# Altium schematic sheet USB_Headers.SchDoc
size A
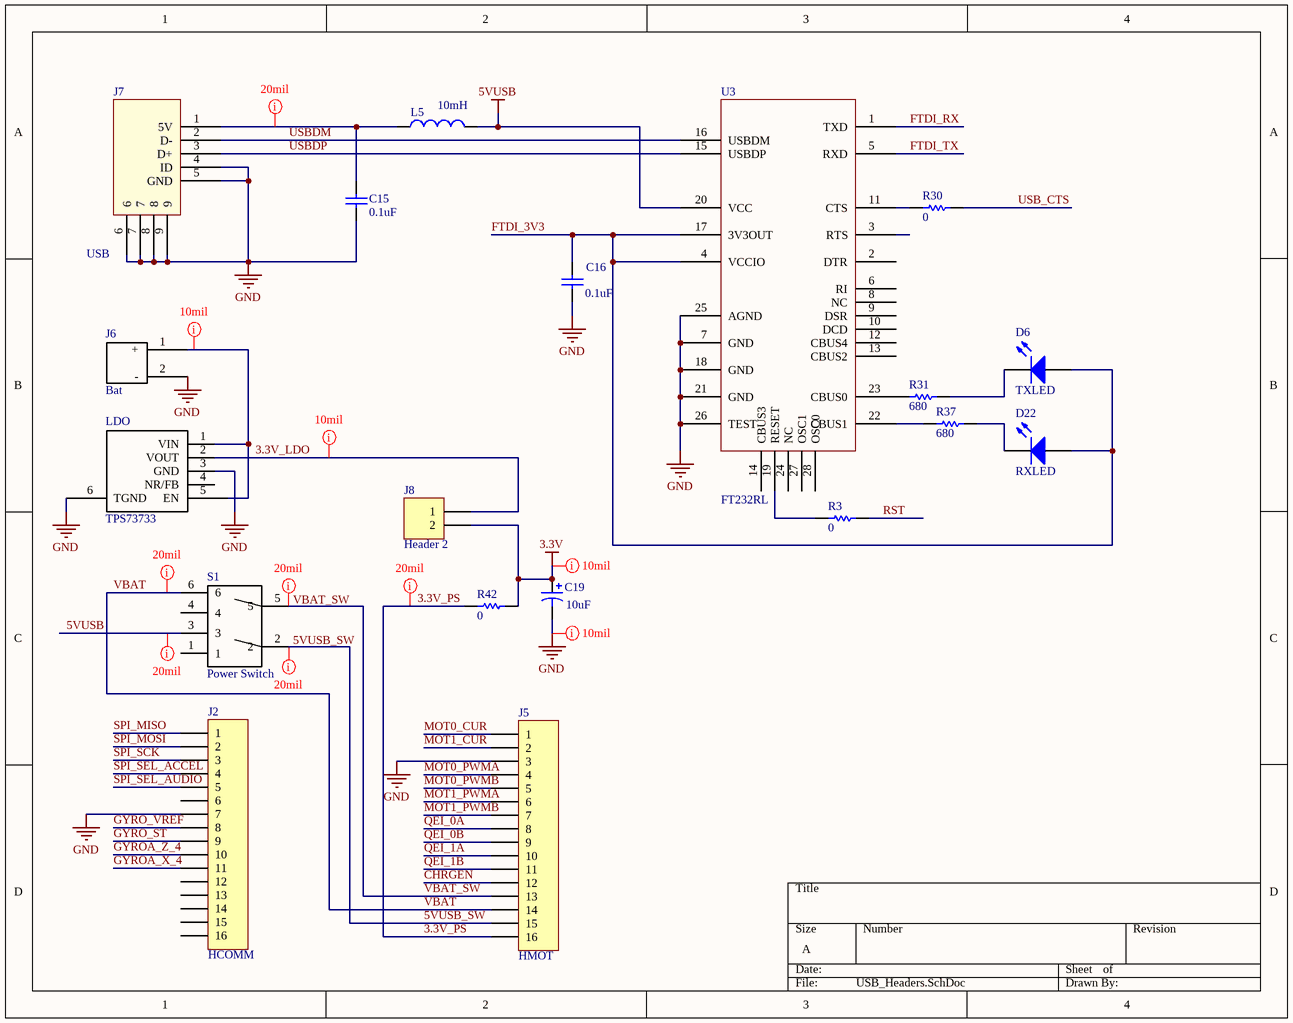
[diagram p0: USB_Headers.SchDoc]

## Parts
C15  value 0.1uF  [CAPC1005L]
C16  value 0.1uF  [CAPC1005L]
C19  value 10uF  [CAPC3216L]  (hidden comment: Cap Pol3)
D6  TXLED  [INDC2012L]
D22  RXLED  [INDC2012L]
J2  HCOMM  [HDR1X16]
J5  HMOT  [HDR1X16]
J6  Bat  [BatteryConnJST]
J7  USB  [USB Minib (thru-hole)]
J8  Header 2  [HDR1X2]
L5  value 10mH  [INDC2012L]  (hidden comment: Inductor)
LDO  TPS73733  [SOT-223-5pin]
R3  value 0  [RESC1608L]
R30  value 0  [RESC1608L]
R31  value 680  [RESC1608L]
R37  value 680  [RESC1608L]
R42  value 0  [RESC3216L]
S1  Power Switch  [DPDTSwitch]
U3  FT232RL  [SSOP-28]

## Nets
3.3V: C19.1 J8.2 R42.2
5VUSB: L5.2 S1.3 U3.20(VCC)
GND: C15.1 C16.1 C19.2 J2.7 J5.3 J6.2(-) J7.4(ID) J7.5(GND) J7.6 J7.7 J7.8 J7.9 LDO.3(GND) LDO.6(TGND) U3.7(GND) U3.18(GND) U3.21(GND) U3.25(AGND) U3.26(TEST)
3.3V_LDO: J8.1 LDO.2(VOUT)
3.3V_PS: J5.16 R42.1
5VUSB_SW: J5.15 S1.2
CHRGEN: J5.12
FTDI_3V3: C16.2 D6.1(A) D22.1(A) U3.4(VCCIO) U3.17(3V3OUT)
FTDI_RX: U3.1(TXD)
FTDI_TX: U3.5(RXD)
GYRO_ST: J2.9
GYRO_VREF: J2.8
GYROA_X_4: J2.11
GYROA_Z_4: J2.10
MOT0_CUR: J5.1
MOT0_PWMA: J5.4
MOT0_PWMB: J5.5
MOT1_CUR: J5.2
MOT1_PWMA: J5.6
MOT1_PWMB: J5.7
QEI_0A: J5.8
QEI_0B: J5.9
QEI_1A: J5.10
QEI_1B: J5.11
RST: R3.2
SPI_MISO: J2.1
SPI_MOSI: J2.2
SPI_SCK: J2.3
SPI_SEL_ACCEL: J2.4
SPI_SEL_AUDIO: J2.5
USB_CTS: R30.2
USBDM: J7.2(D-) U3.16(USBDM)
USBDP: J7.3(D+) U3.15(USBDP)
VBAT: J5.14 S1.6
VBAT_SW: J5.13 S1.5
NetC15_2: C15.2 J7.1(5V) L5.1
NetD6_2: D6.2(K) R31.2
NetD22_2: D22.2(K) R37.2
NetJ6_1: J6.1(+) LDO.1(VIN) LDO.5(EN)
NetR3_1: R3.1 U3.19(RESET)
NetR30_1: R30.1 U3.11(CTS)
NetR31_1: R31.1 U3.23(CBUS0)
NetR37_1: R37.1 U3.22(CBUS1)

Not connected (* = marked no-connect by the designer): J2 6 12 13 14 15 16; LDO 4(NR/FB); S1 1 4; U3 2(DTR) 3(RTS) 6(RI) 8(NC) 9(DSR) 10(DCD) 12(CBUS4) 13(CBUS2) 14(CBUS3) 24(NC) 27(OSC1) 28(OSC0)

## Layout directives
rule Width Constraint [Pref Width = 10mil    Min Width = 10mil    Max Width = 20mil]: 3.3V, 3.3V_PS, 5VUSB, 5VUSB_SW, GND, NetC15_2, VBAT, VBAT_SW
rule Width Constraint [Pref Width = 10mil    Min Width = 10mil    Max Width = 10mil]: 3.3V_LDO, NetJ6_1

## Notes on the sheet
- Labels drawn without touching a wire or pin: 5VUSB_SW, VBAT_SW

## Library data of the parts
C15 C16 = Cap: Capacitor; Published: 8-Jun-2000; LatestRevisionDate: 17-Jul-2002; LatestRevisionNote: Re-released for DXP Platform.; PackageReference: RAD-0.3; Publisher: Altium Limited
C19 = Cap Pol3: Polarized Capacitor (Surface Mount); Published: 8-Jun-2000; LatestRevisionDate: 29-May-2009; LatestRevisionNote: IPC-7351 Footprint Added.; PackageReference: C0805; Publisher: Altium Limited; PackageDescription: Chip Capacitor
D6 D22 = LED2: Typical RED, GREEN, YELLOW, AMBER GaAs LED; Published: 8-Jun-2000; LatestRevisionDate: 17-Jul-2002; LatestRevisionNote: Re-released for DXP Platform.; PackageVersion: Feb-2002; PackageReference: 3.2X1.6X1.1; Publisher: Altium Limited
J2 J5 = Header 16: Header, 16-Pin; LatestRevisionDate: 17-Jul-2002; LatestRevisionNote: Re-released for DXP Platform.; Publisher: Altium Limited
J6 = BatteryConnJST
J7 = USB-ConnTH
J8 = Header 2: Header, 2-Pin; LatestRevisionDate: 17-Jul-2002; LatestRevisionNote: Re-released for DXP Platform.; Publisher: Altium Limited
L5 = Inductor: Code_IEC: 1005; Published: 8-Jun-2000; LatestRevisionDate: 29-May-2009; LatestRevisionNote: IPC-7351 Footprint Added.; PackageReference: 0402-A; Publisher: Altium Limited; PackageDescription: Chip Inductor; Code_JEITA: 0402
LDO = LDO33-TI-TPS73733
R3 R30 R31 R37 R42 = Res1: Resistor; Published: 8-Jun-2000; LatestRevisionDate: 17-Jul-2002; LatestRevisionNote: Re-released for DXP Platform.; PackageReference: AXIAL-0.3; Publisher: Altium Limited
S1 = DPDTSwitch